# EAGLE design TeensyPrototypeBoard (EAGLE 6.5.0)

## Sheet 1 of 3
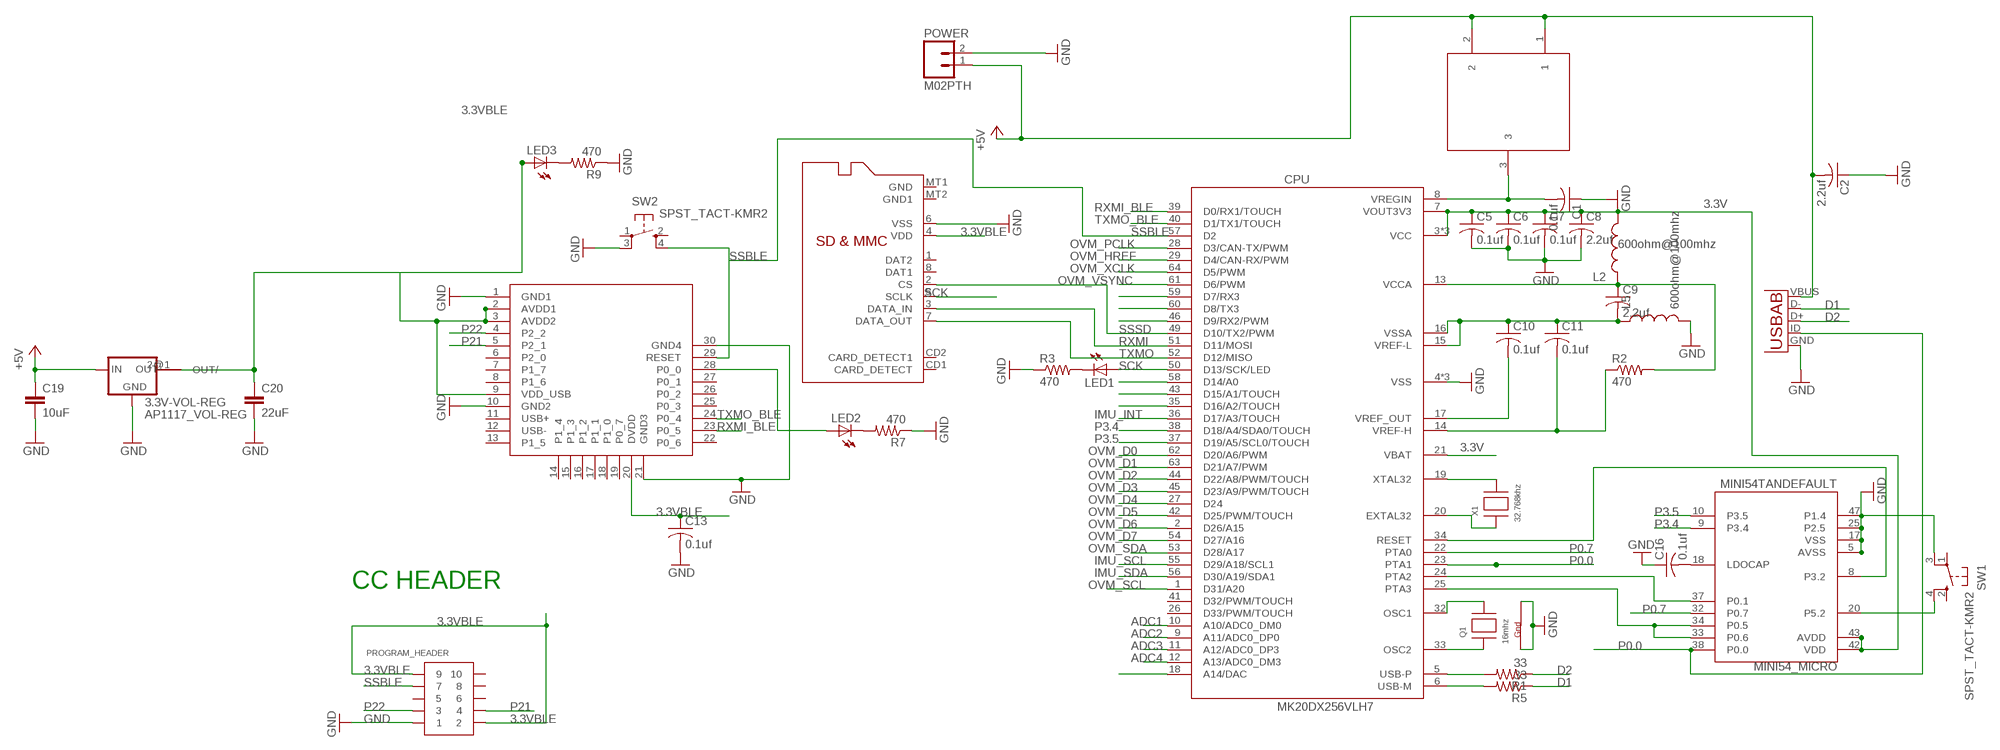
[diagram p0: schematic, sheet 1]

### Parts
3.3V-VOL-REG  AP1117_VOL-REG  [SOT-89]
C1  0.1uf  C-USC0603  [C0603]
C2  2.2uf  C-USC0603  [C0603]
C5  0.1uf  C-USC0603  [C0603]
C6  0.1uf  C-USC0603  [C0603]
C7  0.1uf  C-USC0603  [C0603]
C8  2.2uf  C-USC0603  [C0603]
C9  2.2uf  C-USC0603  [C0603]
C10  0.1uf  C-USC0603  [C0603]
C11  0.1uf  C-USC0603  [C0603]
C13  0.1uf  C-USC0603  [C0603]
C16  0.1uf  C-USC0603  [C0603]
C19  10uF  CAP0603-CAP  [0603-CAP]
C20  22uF  CAP0603-CAP  [0603-CAP]
CPU  MK20DX256VLH7  [QFP50P1200X1200X160-64N]
L2  600ohm@100mhz  INDUCTOR0603  [0603]
L5  600ohm@100mhz  INDUCTOR0603  [0603]
LED1  LEDCHIP-LED0603  [CHIP-LED0603]
LED2  LEDCHIP-LED0603  [CHIP-LED0603]
LED3  LEDCHIP-LED0603  [CHIP-LED0603]
MICRO_SD_CARD_SINK  MICROSD  [MICROSD]
MINI54_MICRO  MINI54TANDEFAULT  [QFP50P900X900X160-48N]
POWER  M02PTH  [1X02]
PROGRAM_HEADER  CONN_5-2-FTSH-V  [FTSH-105-DV]
Q1  16mhz  XTAL-4-3225  [NX3225]
R1  33  R-US_R0603  [R0603]
R2  470  R-US_R0603  [R0603]
R3  470  R-US_R0603  [R0603]
R5  33  R-US_R0603  [R0603]
R7  470  R-US_R0603  [R0603]
R9  470  R-US_R0603  [R0603]
SW1  SPST_TACT-KMR2  [KMR2]
SW2  SPST_TACT-KMR2  [KMR2]
U3  BLE112-A  [BLE112-A]
U$4  PMEG4010CPA  [PMEG4010CPA]
USB  USB-AB  [USB-AB-MICRO-SMD]
X1  32.768khz  XTAL-3.2X1.5  [XTAL3215]

### Nets
3.3V: C5.1 C6.1 C7.1 C8.1 CPU.3(VCC) CPU.7(VOUT3V3) CPU.21(VBAT) CPU.30(VCC) CPU.48(VCC) L2.2 MINI54_MICRO.42(VDD) MINI54_MICRO.43(AVDD)
3.3VBLE: 3.3V-VOL-REG.2(OUT) C13.1 C20.1 LED3.A MICRO_SD_CARD_SINK.4(VDD) PROGRAM_HEADER.2 PROGRAM_HEADER.9 U3.2(AVDD1) U3.3(AVDD2) U3.9(VDD_USB) U3.20(DVDD) ; also sheet 2,3
+5V: 3.3V-VOL-REG.3(IN) C2.2 C19.1 POWER.1 U$4.1 U$4.2 USB.VBUS
ADC1: CPU.10(A10/ADC0_DM0)
ADC2: CPU.9(A11/ADC0_DP0)
ADC3: CPU.11(A12/ADC0_DP3)
ADC4: CPU.12(A13/ADC0_DM3)
D1: R5.1 USB.D-
D2: R1.1 USB.D+
GND: 3.3V-VOL-REG.1(GND) C1.1 C2.1 C5.2 C6.2 C7.2 C8.2 C13.2 C16.1 C19.2 C20.2 CPU.4(VSS) CPU.31(VSS) CPU.47(VSS) L5.2 MICRO_SD_CARD_SINK.6(VSS) MINI54_MICRO.5(AVSS) MINI54_MICRO.17(VSS) MINI54_MICRO.25(P2.5) MINI54_MICRO.47(P1.4) POWER.2 PROGRAM_HEADER.1 Q1.2(G2) Q1.4(G1) R3.1 R7.1 R9.1 SW1.3(P1) SW2.3(P1) U3.1(GND1) U3.10(GND2) U3.21(GND3) U3.30(GND4) USB.GND ; also sheet 2,3
IMU_INT: CPU.36(D17/A3/TOUCH) ; also sheet 2
IMU_SCL: CPU.55(D29/A18/SCL1) ; also sheet 2
IMU_SDA: CPU.56(D30/A19/SDA1) ; also sheet 2
N$1: CPU.19(XTAL32) X1.P$2
N$2: C1.2 CPU.8(VREGIN) U$4.3
N$4: C9.2 C10.1 C11.1 CPU.15(VREF-L) CPU.16(VSSA) L5.1
N$5: C10.2 CPU.17(VREF_OUT)
N$6: C9.1 CPU.13(VCCA) L2.1 R2.2
N$7: C11.2 CPU.14(VREF-H) R2.1
N$8: CPU.20(EXTAL32) X1.P$1
N$9: CPU.32(OSC1) Q1.3(X2)
N$10: CPU.33(OSC2) Q1.1(X1)
N$11: CPU.5(USB-P) R1.2
N$12: CPU.6(USB-M) R5.2
N$13: LED1.C R3.2
N$14: CPU.34(RESET) MINI54_MICRO.8(P3.2)
N$15: CPU.58(D14/A0)
N$16: CPU.43(D15/A1/TOUCH)
N$17: MINI54_MICRO.20(P5.2) SW1.4(S1)
N$18: LED3.C R9.2
N$19: CPU.24(PTA2) MINI54_MICRO.37(P0.1)
N$20: CPU.35(D16/A2/TOUCH)
N$22: CPU.25(PTA3) MINI54_MICRO.33(P0.6) MINI54_MICRO.34(P0.5)
N$26: CPU.18(A14/DAC)
N$28: LED2.C R7.2
N$29: LED2.A U3.28(P0_0)
N$31: CPU.59(D7/RX3)
N$32: CPU.60(D8/TX3)
N$33: CPU.46(D9/RX2/PWM)
N$36: C16.2 MINI54_MICRO.18(LDOCAP)
OVM_D0: CPU.62(D20/A6/PWM) ; also sheet 3
OVM_D1: CPU.63(D21/A7/PWM) ; also sheet 3
OVM_D2: CPU.44(D22/A8/PWM/TOUCH) ; also sheet 3
OVM_D3: CPU.45(D23/A9/PWM/TOUCH) ; also sheet 3
OVM_D4: CPU.27(D24) ; also sheet 3
OVM_D5: CPU.42(D25/PWM/TOUCH) ; also sheet 3
OVM_D6: CPU.2(D26/A15) ; also sheet 3
OVM_D7: CPU.54(D27/A16) ; also sheet 3
OVM_HREF: CPU.29(D4/CAN-RX/PWM) ; also sheet 3
OVM_PCLK: CPU.28(D3/CAN-TX/PWM) ; also sheet 3
OVM_SCL: CPU.1(D31/A20) ; also sheet 3
OVM_SDA: CPU.53(D28/A17) ; also sheet 3
OVM_VSYNC: CPU.61(D6/PWM) ; also sheet 3
OVM_XCLK: CPU.64(D5/PWM) ; also sheet 3
P0.0: CPU.23(PTA1) MINI54_MICRO.38(P0.0) USB.ID(USBID)
P0.7: CPU.22(PTA0) MINI54_MICRO.32(P0.7)
P3.4: CPU.38(D18/A4/SDA0/TOUCH) MINI54_MICRO.9(P3.4)
P3.5: CPU.37(D19/A5/SCL0/TOUCH) MINI54_MICRO.10(P3.5)
P21: PROGRAM_HEADER.4 U3.5(P2_1)
P22: PROGRAM_HEADER.3 U3.4(P2_2)
RXMI: CPU.51(D11/MOSI) MICRO_SD_CARD_SINK.3(DATA_IN)
RXMI_BLE: CPU.39(D0/RX1/TOUCH) U3.23(P0_5)
SCK: CPU.50(D13/SCK/LED) LED1.A MICRO_SD_CARD_SINK.5(SCLK)
SSBLE: CPU.57(D2) PROGRAM_HEADER.7 SW2.4(S1) U3.29(RESET)
SSSD: CPU.49(D10/TX2/PWM) MICRO_SD_CARD_SINK.2(CS)
TXMO: CPU.52(D12/MISO) MICRO_SD_CARD_SINK.7(DATA_OUT)
TXMO_BLE: CPU.40(D1/TX1/TOUCH) U3.24(P0_4)
Unconnected: 3.3V-VOL-REG.2@1(OUT/) CPU.26(D33/PWM/TOUCH) CPU.41(D32/PWM/TOUCH) MICRO_SD_CARD_SINK.1(DAT2) MICRO_SD_CARD_SINK.8(DAT1) MICRO_SD_CARD_SINK.CD1(CARD_DETECT) MICRO_SD_CARD_SINK.CD2(CARD_DETECT1) MICRO_SD_CARD_SINK.MT1(GND) MICRO_SD_CARD_SINK.MT2(GND1) PROGRAM_HEADER.5 PROGRAM_HEADER.6 PROGRAM_HEADER.8 PROGRAM_HEADER.10 SW1.1(P) SW1.2(S) SW2.1(P) SW2.2(S) U3.6(P2_0) U3.7(P1_7) U3.8(P1_6) U3.11(USB+) U3.12(USB-) U3.13(P1_5) U3.14(P1_4) U3.15(P1_3) U3.16(P1_2) U3.17(P1_1) U3.18(P1_0) U3.19(P0_7) U3.22(P0_6) U3.25(P0_3) U3.26(P0_2) U3.27(P0_1)

### Notes on the sheet
- CC HEADER

## Sheet 2 of 3: IMU
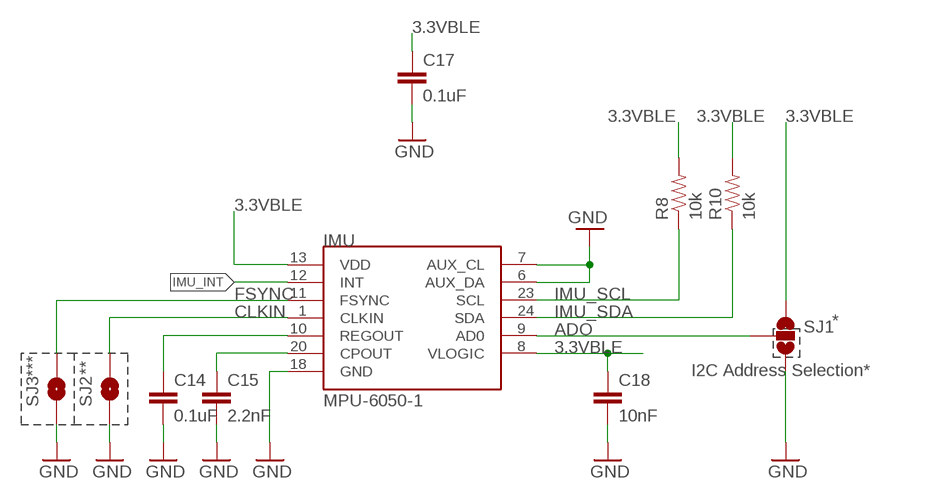
[diagram p1: schematic, sheet 2]

### Parts
C14  0.1uF  CAP0603-CAP  [0603-CAP]
C15  2.2nF  CAP0603-CAP  [0603-CAP]
C17  0.1uF  CAP0603-CAP  [0603-CAP]
C18  10nF  CAP0603-CAP  [0603-CAP]
IMU  MPU-6050-1  [QFN-24-4MM2]
R8  10k  RESISTOR0603-RES  [0603-RES]
R10  10k  RESISTOR0603-RES  [0603-RES]
SJ1  SOLDERJUMPER_2WAYPASTE2&3  [SJ_3_PASTE2&3]
SJ2  SOLDERJUMPERTRACE  [SJ_2S-TRACE]
SJ3  SOLDERJUMPERTRACE  [SJ_2S-TRACE]

### Nets
3.3VBLE: C17.1 C18.1 IMU.8(VLOGIC) IMU.13(VDD) R8.2 R10.2 SJ1.1 ; also sheet 1,3
ADO: IMU.9(AD0) SJ1.2
CLKIN: IMU.1(CLKIN) SJ2.2
FSYNC: IMU.11(FSYNC) SJ3.2
GND: C14.2 C15.2 C17.2 C18.2 IMU.6(AUX_DA) IMU.7(AUX_CL) IMU.18(GND) SJ1.3 SJ2.1 SJ3.1 ; also sheet 1,3
IMU_INT: IMU.12(INT) ; also sheet 1
IMU_SCL: IMU.23(SCL) R8.1 ; also sheet 1
IMU_SDA: IMU.24(SDA) R10.1 ; also sheet 1
N$3: C15.1 IMU.20(CPOUT)
N$23: C14.1 IMU.10(REGOUT)

### Notes on the sheet
- *
- *** | ** | I2C Address Selection*

## Sheet 3 of 3: CAMERA MODULE
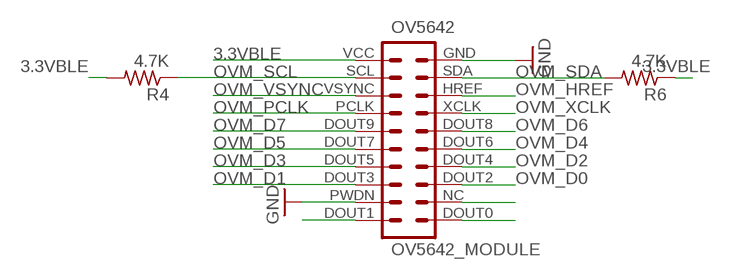
[diagram p2: schematic, sheet 3]

### Parts
OV5642  OV5642_MODULE  [OV5642_MODULE]
R4  4.7K  R-US_R0603  [R0603]
R6  4.7K  R-US_R0603  [R0603]

### Nets
3.3VBLE: OV5642.VCC R4.2 R6.1 ; also sheet 1,2
GND: OV5642.GND OV5642.PWDN ; also sheet 1,2
N$41: OV5642.DOUT1
N$48: OV5642.NC
N$49: OV5642.DOUT0
OVM_D0: OV5642.DOUT2 ; also sheet 1
OVM_D1: OV5642.DOUT3 ; also sheet 1
OVM_D2: OV5642.DOUT4 ; also sheet 1
OVM_D3: OV5642.DOUT5 ; also sheet 1
OVM_D4: OV5642.DOUT6 ; also sheet 1
OVM_D5: OV5642.DOUT7 ; also sheet 1
OVM_D6: OV5642.DOUT8 ; also sheet 1
OVM_D7: OV5642.DOUT9 ; also sheet 1
OVM_HREF: OV5642.HREF ; also sheet 1
OVM_PCLK: OV5642.PCLK ; also sheet 1
OVM_SCL: OV5642.SCL R4.1 ; also sheet 1
OVM_SDA: OV5642.SDA R6.2 ; also sheet 1
OVM_VSYNC: OV5642.VSYNC ; also sheet 1
OVM_XCLK: OV5642.XCLK ; also sheet 1

## Library data of the parts
3.3V-VOL-REG = Chao:AP1117_VOL-REG
C1 C2 C5-C11 C13 C16 = resistor:C-US: CAPACITOR, American symbol
C14 C15 C17-C20 = SparkFun:CAP: Capacitor Standard 0603 ceramic capacitor, and 0.1" leaded capacitor.
CPU = Teensy_3_Series_Chip_v1.0:MK20DX256VLH7: This is a footprint for the MK20dx256VHL7, the chip at the heart of the Teensy 3.1. Notable upgrades over the Teensy 3.0 include more Flash Memory, RAM, a DAC output, additional ADC pins, etc. Remember, if you want to use USB, VOut3v3 has to be attached to the 3.3V bus.
IMU = Testing:MPU-6050
L2 L5 = SparkFun-Passives:INDUCTOR: Inductors Basic Inductor/Choke - 0603 and 1206. Footprints are not proven and vary greatly between part numbers. SRN6045- 33uH, 20% 1.4A
LED1-LED3 = adafruit:LED: LED OSRAM: - CHIPLED LG R971, LG N971, LY N971, LG Q971, LY Q971, LO R971, LY R971 LH N974, LH R974 LS Q976, LO Q976, LY Q976 LO Q996 - Hyper CHIPLED LW Q18S LB Q993, LB Q99A, LB R99A - SideLED LS A670, LO A670, LY A670, LG A670, LP A670 LB A673, LV A673, LT A673, LW A673 LH A674 LY A675 LS A676, LA A676, LO A676, LY A676, LW A676 LS A679, LY A679, LG A679 - Hyper Micro SIDELED® LS Y876, LA Y876, LO Y876, LY Y876 LT Y87S - SmartLED LW L88C, LW L88S LB L89C, LB L89S, LG L890 LS L89K, LO L89K, LY L89K LS L896, LA L896, LO L896, LY L896 - TOPLED LS T670, LO T670, LY T670, LG T670, LP T670 LSG T670, LSP T670, LSY T670, LOP T670, LYG T670 LG T671, LOG T671, LSG T671 LB T673, LV T673, LT T673, LW T673 LH T674 LS T676, LA T676, LO T676, LY T676, LB T676, LH T676, LSB T676, LW T676 LB T67C, LV T67C, LT T67C, LS T67K, LO T67K, LY T67K, LW E67C LS E67B, LA E67B, LO E67B, LY E67B, LB E67C, LV E67C, LT E67C LW T67C LS T679, LY T679, LG T679 LS T770, LO T770, LY T770, LG T770, LP T770 LB T773, LV T773, LT T773, LW T773 LH T774 LS E675, LA E675, LY E675, LS T675 LS T776, LA T776, LO T776, LY T776, LB T776 LHGB T686 LT T68C, LB T68C - Hyper Mini TOPLED® LB M676 - Mini TOPLED Santana® LG M470 LS M47K, LO M47K, LY M47K Source: http://www.osram.convergy.de/
MICRO_SD_CARD_SINK = adafruit:MICROSD: Micro-SD / Transflash card holder with SPI pinout For the 3M # 2908-05WB-MG and/or 4UCON #19656 push-push type
MINI54_MICRO = Teensy_3_Series_Chip_v1.0:MINI54TAN: MINI54TAN Bootloader from PJRC.com, preprogrammed with Teensy 3.0 bootloader. https://www.pjrc.com/store/ic_mini54_tqfp.html
OV5642 = Chao:OV5642_MODULE
POWER = SparkFun-Connectors:M02: Standard 2-pin 0.1" header. Use with - straight break away headers ( PRT-00116) - right angle break away headers (PRT-00553) - swiss pins (PRT-00743) - machine pins (PRT-00117) - female headers (PRT-00115) Molex polarized connector foot print use with: PRT-08233 with associated crimp pins and housings. 2.54_SCREWTERM for use with PRT-10571. 3.5mm Screw Terminal footprints for PRT-08084 5mm Screw Terminal footprints for use with PRT-08433
PROGRAM_HEADER = pel_misc:CONN_5-2
Q1 = adafruit:XTAL-4: Classic 4-pin 3.2 x 2.5mm crystal
R1-R7 R9 = resistor:R-US_: RESISTOR, American symbol
R8 R10 = SparkFun:RESISTOR: Resistor Basic schematic elements and footprints for 0603, 1206, and PTH resistors.
SJ1 = SparkFun:SOLDERJUMPER_2WAY: Solder Jumper 2 way solder jumper
SJ2 SJ3 = SparkFun:SOLDERJUMPER: Solder Jumper Standard SMD solder jumper. Used to automate production. Two varients : Normally Open and Normally Closed are the same, but have different paste layers. NC will have a large amount of paste and should jumper during reflow.
SW1 SW2 = adafruit:SPST_TACT: SMT 6mm switch, EVQQ2 series http://www.ladyada.net/library/eagle
U3 = SparkFun-RF:BLE112-A: BlueGiga Bluetooth 4.0 module with integrated chip antenna and onboard 8051 processor and peripherals
U$4 = zz_cbhar:PMEG4010CPA
USB = SparkFun-Connectors:USB-AB: This is a USB AB connector that is compatible with USB OTG. i.e. this connector can serve as a host or device
X1 = adafruit:XTAL: Low cost SMT crystals, no capacitors included http://www.ladyada.net/library/eagle

## Board
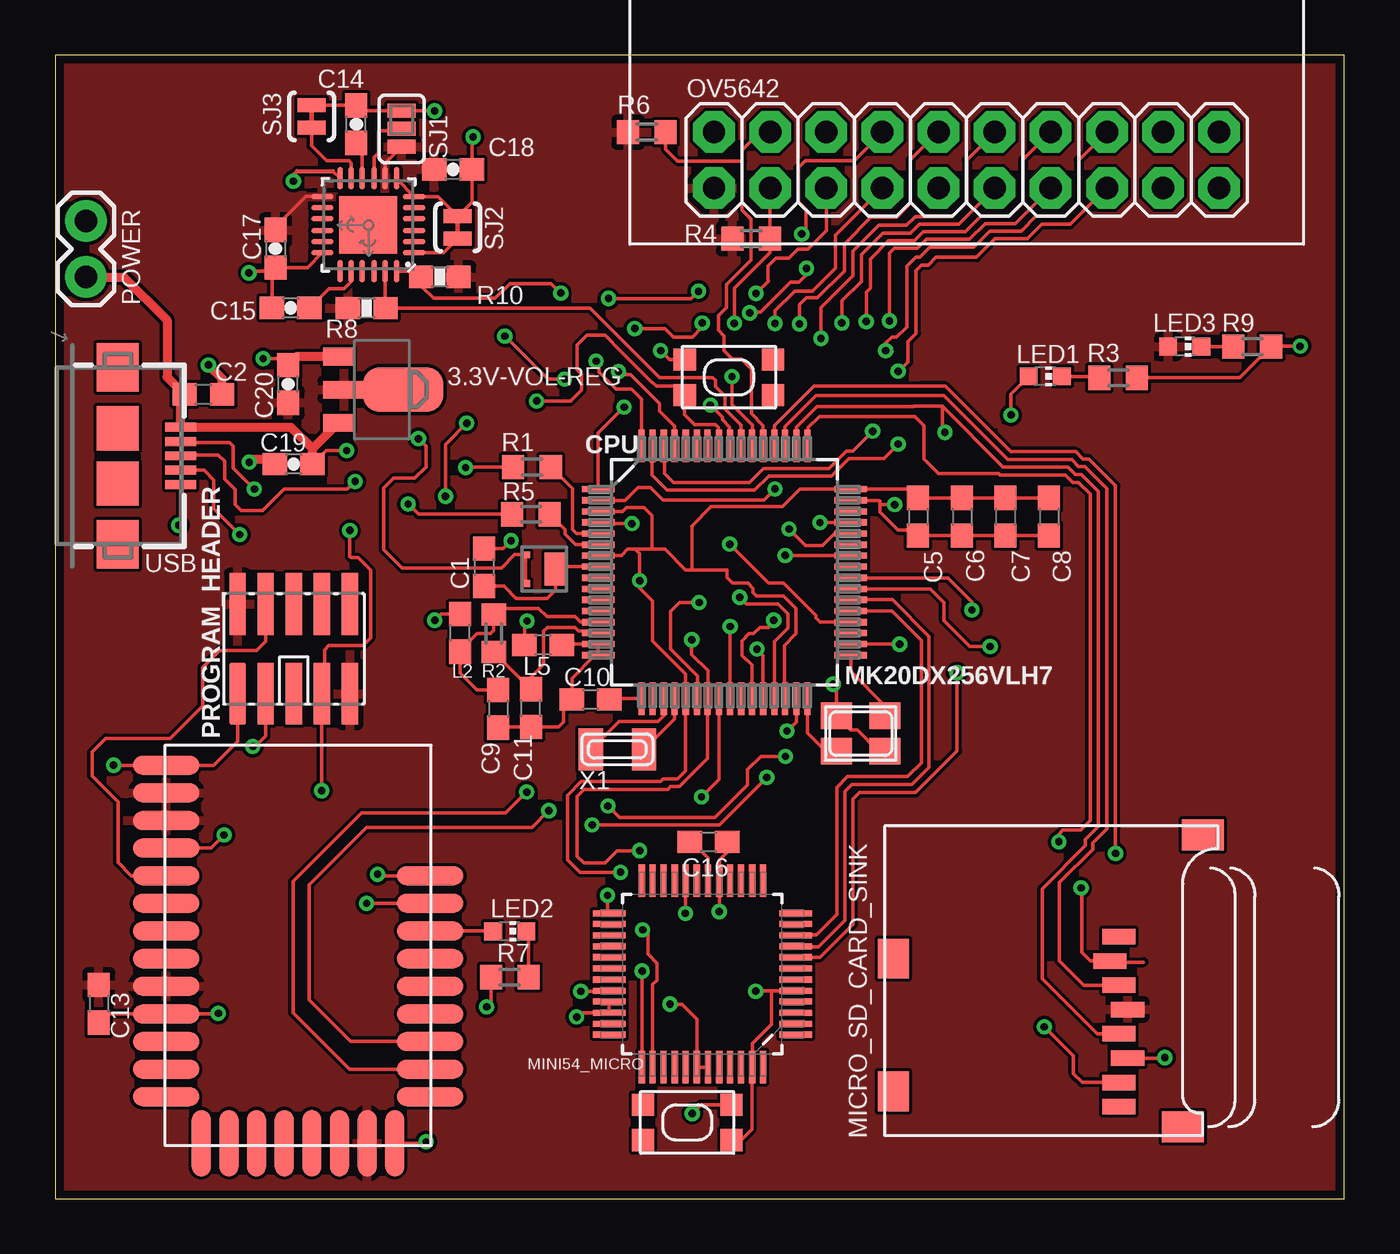
[diagram p3: board, top side]
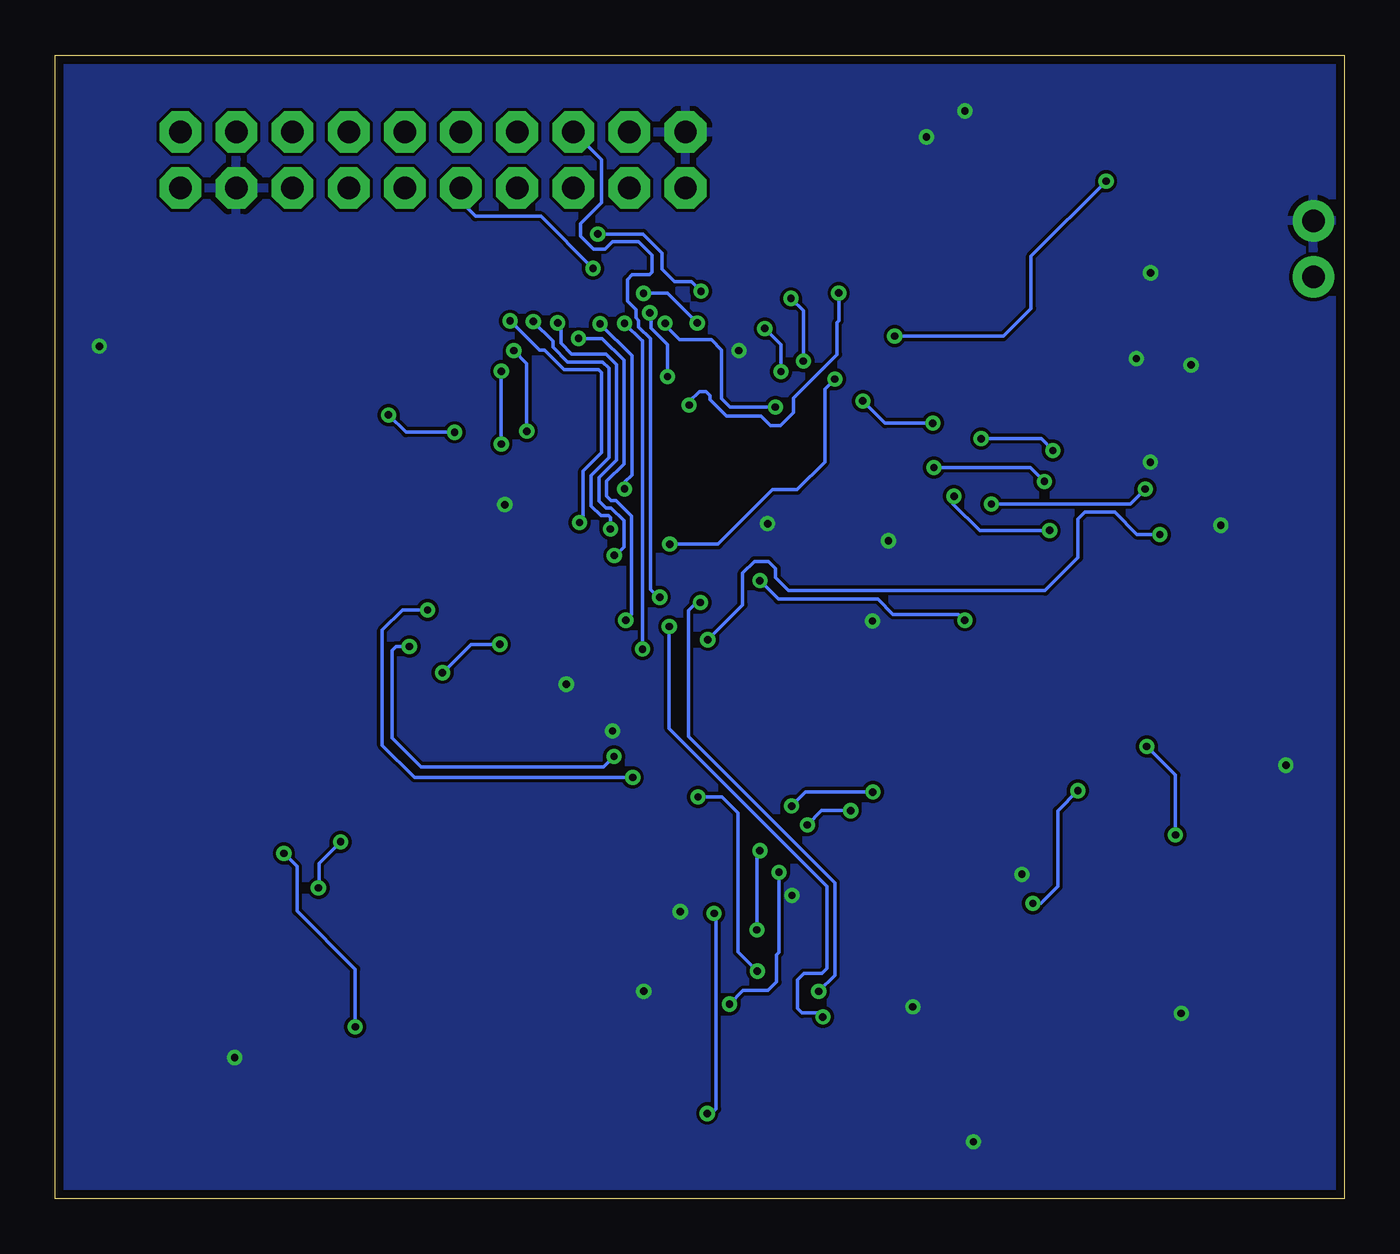
[diagram p4: board, bottom side, seen from below]

Size 58.32 x 51.74 mm. Coordinates in mm from the lower left corner, seen from the top.
Outline: 0,0 58.32,0 58.32,51.74 0,51.74 0,0
Copper layers (1*16): Top 0.0356mm / dielectric 1.5011mm / Bottom 0.0356mm
Design rules "LaenPCBOrder": minimum track width 6mil, minimum drill 13mil, track to track 6mil, track to pad 6mil, pad to pad 6mil, via to via 6mil, smd to smd 6mil, copper to edge 15mil, drill to drill 6mil, minimum pad ring 7mil, minimum via ring 7mil, stop-mask expansion 3mil, vias tented up to drill 0mil, thermal gap 10mil

### Footprints (pad centres in the part's own frame; a part is rotated, then mirrored left to right if it is on the bottom)
SOT-89 = smd 0.8 x 1.4: 1 -1.499,-1.981; 3 1.499,-1.981 | smd 0.8 x 1.9: 2 0,-1.727 | smd 2.032 x 3.65: 2@1 0,0.94
C0603 = smd 1.1 x 1: 1 -0.85,0; 2 0.85,0
0603-CAP = smd 1.1 x 1: 1 -0.85,0; 2 0.85,0
QFP50P1200X1200X160-64N = smd 1.473 x 0.279: 1 -5.715,3.759; 2 -5.715,3.251; 3 -5.715,2.743; 4 -5.715,2.261; 5 -5.715,1.753; 6 -5.715,1.245; 7 -5.715,0.762; 8 -5.715,0.254; 9 -5.715,-0.254; 10 -5.715,-0.762; 11 -5.715,-1.245; 12 -5.715,-1.753; 13 -5.715,-2.261; 14 -5.715,-2.743; 15 -5.715,-3.251; 16 -5.715,-3.759; 33 5.715,-3.759; 34 5.715,-3.251; 35 5.715,-2.743; 36 5.715,-2.261; 37 5.715,-1.753; 38 5.715,-1.245; 39 5.715,-0.762; 40 5.715,-0.254; 41 5.715,0.254; 42 5.715,0.762; 43 5.715,1.245; 44 5.715,1.753; 45 5.715,2.261; 46 5.715,2.743; 47 5.715,3.251; 48 5.715,3.759 | smd 0.279 x 1.473: 17 -3.759,-5.715; 18 -3.251,-5.715; 19 -2.743,-5.715; 20 -2.261,-5.715; 21 -1.753,-5.715; 22 -1.245,-5.715; 23 -0.762,-5.715; 24 -0.254,-5.715; 25 0.254,-5.715; 26 0.762,-5.715; 27 1.245,-5.715; 28 1.753,-5.715; 29 2.261,-5.715; 30 2.743,-5.715; 31 3.251,-5.715; 32 3.759,-5.715; 49 3.759,5.715; 50 3.251,5.715; 51 2.743,5.715; 52 2.261,5.715; 53 1.753,5.715; 54 1.245,5.715; 55 0.762,5.715; 56 0.254,5.715; 57 -0.254,5.715; 58 -0.762,5.715; 59 -1.245,5.715; 60 -1.753,5.715; 61 -2.261,5.715; 62 -2.743,5.715; 63 -3.251,5.715; 64 -3.759,5.715
QFN-24-4MM2 = smd 1.016 x 0.254: 1 -2.066,1.257; 2 -2.066,0.75; 3 -2.066,0.247; 4 -2.066,-0.287; 5 -2.066,-0.792; 6 -2.066,-1.297; 13 2.086,-1.297; 14 2.086,-0.792; 15 2.086,-0.287; 16 2.086,0.247; 17 2.086,0.75; 18 2.086,1.257 | smd 0.254 x 1.016: 7 -1.267,-2.122; 8 -0.762,-2.122; 9 -0.258,-2.122; 10 0.278,-2.122; 11 0.78,-2.122; 12 1.287,-2.122; 19 1.287,2.082; 20 0.78,2.082; 21 0.278,2.082; 22 -0.258,2.082; 23 -0.762,2.082; 24 -1.267,2.082 | smd 2.616 x 2.616: P$1 0.02,-0.01
0603 = smd 1.1 x 1: 1 -0.85,0; 2 0.85,0
CHIP-LED0603 = smd 0.8 x 0.8: A 0,-0.75; C 0,0.75
MICROSD = smd 0.7 x 1.5: 1 9,-10.64; 2 7.9,-10.24; 3 6.8,-10.64; 4 5.7,-11.04; 5 4.6,-10.64; 6 3.5,-11.04; 7 2.4,-10.64; 8 1.3,-10.64 | smd 1.8 x 1.4: CD1 2,-0.44; CD2 8,-0.44 | smd 1.4 x 1.9: MT1 0.4,-13.54; MT2 13.6,-14.44
QFP50P900X900X160-48N = smd 1.473 x 0.279: 1 -4.216,2.743; 2 -4.216,2.261; 3 -4.216,1.753; 4 -4.216,1.245; 5 -4.216,0.762; 6 -4.216,0.254; 7 -4.216,-0.254; 8 -4.216,-0.762; 9 -4.216,-1.245; 10 -4.216,-1.753; 11 -4.216,-2.261; 12 -4.216,-2.743; 25 4.216,-2.743; 26 4.216,-2.261; 27 4.216,-1.753; 28 4.216,-1.245; 29 4.216,-0.762; 30 4.216,-0.254; 31 4.216,0.254; 32 4.216,0.762; 33 4.216,1.245; 34 4.216,1.753; 35 4.216,2.261; 36 4.216,2.743 | smd 0.279 x 1.473: 13 -2.743,-4.216; 14 -2.261,-4.216; 15 -1.753,-4.216; 16 -1.245,-4.216; 17 -0.762,-4.216; 18 -0.254,-4.216; 19 0.254,-4.216; 20 0.762,-4.216; 21 1.245,-4.216; 22 1.753,-4.216; 23 2.261,-4.216; 24 2.743,-4.216; 37 2.743,4.216; 38 2.261,4.216; 39 1.753,4.216; 40 1.245,4.216; 41 0.762,4.216; 42 0.254,4.216; 43 -0.254,4.216; 44 -0.762,4.216; 45 -1.245,4.216; 46 -1.753,4.216; 47 -2.261,4.216; 48 -2.743,4.216
OV5642_MODULE = drill 1.016 pad 1.88 octagon: DOUT0 11.43,1.27; DOUT1 11.43,-1.27; DOUT2 6.35,1.27; DOUT3 6.35,-1.27; DOUT4 3.81,1.27; DOUT5 3.81,-1.27; DOUT6 1.27,1.27; DOUT7 1.27,-1.27; DOUT8 -1.27,1.27; DOUT9 -1.27,-1.27; GND -11.43,1.27; HREF -6.35,1.27; NC 8.89,1.27; PCLK -3.81,-1.27; PWDN 8.89,-1.27; SCL -8.89,-1.27; SDA -8.89,1.27; VCC -11.43,-1.27; VSYNC -6.35,-1.27; XCLK -3.81,1.27
1X02 = drill 1.016 pad 1.88: 1 0,0; 2 2.54,0
FTSH-105-DV = smd 0.74 x 2.8: 1 -2.54,-2.03; 2 -2.54,2.03; 3 -1.27,-2.03; 4 -1.27,2.03; 5 0,-2.03; 6 0,2.03; 7 1.27,-2.03; 8 1.27,2.03; 9 2.54,-2.03; 10 2.54,2.03
NX3225 = smd 1.4 x 1.2: 1 -1.1,-0.8; 2 1.1,-0.8; 3 1.1,0.8; 4 -1.1,0.8
R0603 = smd 1 x 1.1: 1 -0.85,0; 2 0.85,0
0603-RES = smd 1.1 x 1: 1 -0.85,0; 2 0.85,0
SJ_3_PASTE2&3 = smd 0.635 x 1.27: 1 -0.813,0; 2 0,0; 3 0.813,0
SJ_2S-TRACE = smd 0.635 x 1.27: 1 -0.508,0; 2 0.508,0
KMR2 = smd 1 x 1: 1 2,0.8; 2 2,-0.8; 3 -2,0.8; 4 -2,-0.8
BLE112-A = smd 3 x 0.85: 1 0.05,17.2; 2 0.05,15.95; 3 0.05,14.7; 4 0.05,13.45; 5 0.05,12.2; 6 0.05,10.95; 7 0.05,9.7; 8 0.05,8.45; 9 0.05,7.2; 10 0.05,5.95; 11 0.05,4.7; 12 0.05,3.45; 13 0.05,2.2; 22 12,2.2; 23 12,3.45; 24 12,4.7; 25 12,5.95; 26 12,7.2; 27 12,8.45; 28 12,9.7; 29 12,10.95; 30 12,12.2 | smd 0.85 x 3: 14 1.65,0.1; 15 2.9,0.1; 16 4.15,0.1; 17 5.4,0.1; 18 6.65,0.1; 19 7.9,0.1; 20 9.15,0.1; 21 10.4,0.1
PMEG4010CPA = smd 0.3 x 0.4: 1 -0.65,-0.85; 2 0.65,-0.85 | smd 1.5 x 1: 3 0,0.5
USB-AB-MICRO-SMD = smd 1.4 x 0.4: D+ 2.85,0; D- 2.85,0.65; GND 2.85,-1.3; ID 2.85,-0.65; VBUS 2.85,1.3 | smd 1.9 x 2: P$6 0,1.25; P$7 0,-1.25 | smd 1.9 x 2.2: P$8 0,4; P$9 0,-4
XTAL3215 = smd 1.1 x 1.9: P$1 1.2,0; P$2 -1.2,0

### Placement (x,y rotation side)
3.3V-VOL-REG  14.79,36.61 270 top
C1  19.4,28.57 270 top
C2  6.7,36.39 180 top
C5  39.04,30.86 270 top
C6  41.02,30.86 270 top
C7  42.99,30.86 270 top
C8  44.96,30.86 270 top
C9  20.04,22.17 270 top
C10  24.22,22.6 0 top
C11  21.52,22.2 90 top
C13  1.97,8.82 270 top
C14  13.62,48.62 90 top
C15  10.65,40.31 180 top
C16  29.56,16.14 180 top
C17  9.96,42.98 270 top
C18  18,46.57 0 top
C19  10.78,33.24 180 top
C20  10.54,36.87 90 top
CPU  30.28,28.35 0 top
IMU  14.17,44.06 180 top
L2  18.32,25.61 90 top
L5  22.08,25.06 180 top
LED1  44.79,37.21 270 top
LED2  20.56,12.1 270 top
LED3  51.11,38.56 270 top
MICRO_SD_CARD_SINK  37.48,2.86 90 top
MINI54_MICRO  29.28,10.17 180 top
OV5642  41.24,47 0 top
POWER  1.39,41.71 90 top
PROGRAM_HEADER  10.79,24.88 0 top
Q1  36.45,21.05 180 top
R1  21.57,33.11 0 top
R2  19.84,25.58 90 top
R3  48.09,37.15 180 top
R4  31.49,43.44 180 top
R5  21.52,30.97 0 top
R6  26.76,48.26 0 top
R7  20.56,10.03 0 top
R8  14.1,40.3 180 top
R9  54.16,38.56 180 top
R10  17.4,41.71 0 top
SJ1  15.68,48.41 90 top
SJ2  18.21,43.95 270 top
SJ3  11.6,48.98 270 top
SW1  28.59,3.45 180 top
SW2  30.48,37.17 0 top
U3  4.96,2.42 0 top
U$4  22.13,28.49 270 top
USB  2.83,33.61 0 top
X1  25.44,20.34 0 top

### Tracks (layer width: path | path; a pad name or v marks a point on that pad's centre or on a via)
3.3V  (via drill 0.33)
  Top 0.152: CPU.3 25.67,31.09 25.85,31.27 26.64,31.27 26.99,30.91 26.99,29.39 | CPU.7 25.61,29.11 25.89,29.39 26.24,29.39 | CPU.30 32.99,22.67 32.99,25.04 33.52,25.57 33.52,26.71 32.95,27.28 31.73,27.28 31.58,27.43 31.58,27.62 31.35,27.85 30.64,27.85 30.39,28.11 30.39,28.44 28.82,28.44 | 26.99,29.39 27.58,29.39 28.53,28.44 28.82,28.44 | 26.99,29.39 26.24,29.39 | C8.1 C7.1 C6.1 C5.1 38.64,32.11 CPU.48 33.7,32.11 32.9,31.32 29.67,31.32 28.8,30.45 28.8,28.47 28.82,28.44 | L2.2 17.45,26.46 v17.17,26.18 | 26.24,29.39 26.44,29.19 v26.44,27.97 26.44,27.63 27.03,27.04 27.03,25.25 28.52,23.75 CPU.21 28.53,19.37 28.16,19 27.5,19 27.38,18.87 23.79,18.87 23.18,18.26 23.18,15.34 23.75,14.77 v25.58,14.77 | MINI54_MICRO.43 MINI54_MICRO.42 29.04,5.97 29.04,8.12 28.35,8.8 v27.81,8.8
  Bottom 0.152: v17.17,26.18 17.19,26.18 17.45,26.44 20.42,26.44 21.1,27.13 25.61,27.13 v26.44,27.97 | v27.81,8.8 27.2,9.42 26.07,9.42 25.69,9.81 25.69,11.03 25.58,11.14 v25.58,14.77
3.3VBLE
  Top 0.152: C17.1 9.97,43.99 11.34,45.37 12.07,45.37 IMU.13 | IMU.8 14.94,46.86 SJ1.1
  pour Top: -3.81,55.88 62.23,55.88 62.23,-1.27 -3.81,-1.27
+5V  (via drill 0.33)
  Top 0.152: U$4.2 U$4.1 20.79,29.14 20.19,28.54 15.7,28.54 14.87,29.37 14.87,32.16 15.3,32.6 16.27,32.6 16.77,33.1 16.77,34.05 v16.43,34.39 | C19.1 12.25,33.85 v13.18,33.85
  Top 0.406: C19.1 11.63,33.93 | 11.63,33.93 3.3V-VOL-REG.3 | POWER.1 3.11,41.7 5.06,39.75 5.06,37.19 C2.2 5.68,36.22 USB.VBUS 10.65,34.91 11.63,33.93
  Bottom 0.152: v13.18,33.85 13.71,34.39 v16.43,34.39
ADO
  Top 0.152: IMU.9 14.44,47.13 14.63,47.32 14.63,48.28 14.67,48.32 15.59,48.32 SJ1.2
CLKIN
  Top 0.152: IMU.1 17.57,42.8 SJ2.2
D1  (via drill 0.33)
  Top 0.152: USB.D- 5.73,34.22 7.89,34.22 8.05,34.05 8.05,33.06 v9.01,32.11 v9.01,32.1 | v15.97,31.44 16.43,30.97 R5.1
  Bottom 0.152: v9.01,32.11 9.68,31.44 v15.97,31.44
D2  (via drill 0.33)
  Top 0.152: USB.D+ 5.7,33.59 5.77,33.66 7.38,33.66 7.67,33.37 7.67,32.55 8.13,32.08 8.13,31.42 8.41,31.15 9.37,31.15 10.35,32.12 13.21,32.12 13.54,32.46 v13.57,32.46 | v18.56,33.08 18.59,33.11 R1.1
  Bottom 0.152: v13.57,32.46 14.2,33.08 v18.56,33.08
FSYNC
  Top 0.152: 11.6,48.21 SJ3.2 11.6,47.64 12.28,46.96 13.29,46.96 13.39,46.85 IMU.11
GND  (via drill 0.33)
  Top 0.152: IMU.7 15.44,46.15 IMU.6 17.32,45.35 SJ2.1 18.85,45.1 C18.2 18.85,47.99 v18.9,48.05 | C15.2 9.8,41.97 | 9.8,41.97 C17.2 11.42,42.13 IMU.18 | 9.8,41.97 8.84,41.97 v8.76,41.89 | C13.2 2.36,8.37 U3.10 7.35,8.37 v7.38,8.39 | U3.21 16.72,2.52 v16.78,2.58 | R7.1 19.71,8.87 v19.52,8.68 | U3.30 14.65,14.62 v14.58,14.68 | v2.64,19.62 v2.64,19.61 U3.1 7.17,19.61 8.24,20.68 PROGRAM_HEADER.1 | MICRO_SD_CARD_SINK.6 50.18,6.36 v50.2,6.39 | USB.GND 5.68,30.57 v5.58,30.47 | C8.2 C7.2 | C7.2 | C7.2 C6.2 C5.2 | C5.2 | CPU.47 37.27,31.6 37.3,31.57 37.3,31.41 | 37.3,31.41 37.3,31.08 38.12,30.26 38.78,30.26 C5.2 | v37.98,31.4 37.32,31.4 37.3,31.41 | v26.09,30.55 24.63,30.55 CPU.4 | L5.2 21.23,26.01 v21.35,26.14 | C1.1 20.27,29.42 v20.62,29.77 | Q1.4 37.26,20.25 36.29,21.21 35.98,21.21 Q1.2 35.35,23.13 v35.2,23.28 | CPU.31 33.53,21.58 v33.11,21.16 | v56.33,38.57 55.02,38.57 R9.1 53.6,37.15 R3.1 | SW1.3 31.03,2.65 31.52,3.15 31.52,5.94 MINI54_MICRO.47 31.54,7.03 32.41,7.9 32.41,9.41 | C16.1 30.41,15.7 30.05,15.34 MINI54_MICRO.17 | MINI54_MICRO.17 | MINI54_MICRO.17 v30.05,12.99 v30.04,12.99 | MINI54_MICRO.5 32.41,9.41 | 32.41,9.41 31.71,9.41 v31.69,9.39 | MINI54_MICRO.25 24.99,12.99 v24.99,13.72 | C20.2 10.25,38.01 v9.4,38.01 | SJ3.1 13.54,49.48 C14.2 13.8,49.22 SJ1.3 v17.16,49.22 | SW2.3 27.8,37.97 v27.39,38.38
  Top 0.406: 5,19.63 U3.1 | C19.2 9.72,33.46 8.9,33.46 v8.77,33.33 | C2.1 7.55,37.1 v6.93,37.73 | 3.3V-VOL-REG.1 10.93,38.1 C20.2
  pour Bottom: -3.81,55.88 62.23,55.88 62.23,-1.27 -3.81,-1.27
IMU_INT  (via drill 0.33)
  Top 0.152: CPU.36 34.61,26.09 34.42,26.28 34.42,26.4 32.95,27.87 32.26,27.87 v30.51,29.62 | v23.05,37.08 22.29,37.08 v20.34,39.03 | v10.77,46.05 10.77,46.33 10.94,46.5 | 12.56,46.5 IMU.12
  Top 0.178: 10.94,46.5 12.56,46.5
  Bottom 0.152: v30.51,29.62 28.33,29.62 25.86,32.09 24.75,32.09 23.5,33.34 23.5,36.63 v23.05,37.08 | v20.34,39.03 15.43,39.03 14.17,40.28 14.17,42.65 v10.77,46.05
IMU_SCL
  Top 0.152: IMU.23 14.94,40.32 R8.1 24.19,40.3 27.34,37.16 29.75,37.16 29.87,37.03 29.87,36.75 30.3,36.33 30.3,35.73 31.03,35 31.03,34.08 CPU.55
IMU_SDA  (via drill 0.33)
  Top 0.152: IMU.24 16.29,41.97 R10.1 16.55,41.3 17.11,40.74 19.91,40.74 20.58,41.42 22.44,41.42 v22.87,40.98 | CPU.56 30.51,34.08 30.51,34.92 30.18,35.26 30.18,35.37 v29.64,35.91
  Bottom 0.152: v22.87,40.98 22.87,39.73 22.95,39.65 22.95,38.2 24.93,36.23 24.93,35.58 25.51,34.99 25.96,34.99 26.39,35.42 27.96,35.42 28.7,36.17 28.7,36.34 28.89,36.52 29.18,36.52 29.64,36.06 v29.64,35.91
N$1
  Top 0.152: X1.P$2 25.5,21.6 27.27,21.6 27.54,21.86 CPU.19
N$2
  Top 0.152: CPU.8 22.75,28.6 U$4.3 22.63,27.54 22.26,27.17 20.85,27.17 20.3,27.72 C1.2
N$3
  Top 0.152: IMU.20 13.39,41.5 13.08,41.19 12.38,41.19 C15.1
N$4
  Top 0.152: C9.2 20.07,21.35 C11.1 22.77,21.35 23,21.58 23,22.22 C10.1 23.37,23.55 24.41,24.59 CPU.16 CPU.15 22.96,25.1 L5.1
N$5
  Top 0.152: CPU.17 25.11,22.63 C10.2
N$6
  Top 0.152: C9.1 19.09,23.02 18.33,23.78 L2.1 | L2.1 | L2.1 18.33,24.81 19.09,25.58 19.71,25.58 19.84,25.7 R2.2 20.12,26.71 21.87,26.71 22.25,26.33 23.52,26.33 23.76,26.09 CPU.13
N$7
  Top 0.152: R2.1 C11.2 21.52,23.61 22.1,24.18 22.1,25.68 22.27,25.86 23.52,25.86 23.68,25.7 24.47,25.7 CPU.14
N$8
  Top 0.152: X1.P$1 28.02,21.72 CPU.20
N$9
  Top 0.152: Q1.3 34.86,20.25 34.04,21.07 CPU.32
N$10
  Top 0.152: Q1.1 37.55,22.3 35.99,23.86 CPU.33
N$11
  Top 0.152: CPU.5 23.58,30.1 23.39,30.29 23.39,32.14 R1.2
N$12
  Top 0.152: CPU.6 23.55,29.59 23.07,30.07 23.07,30.28 R5.2
N$13
  Top 0.152: LED1.C 47.18,37.21 R3.2
N$14  (via drill 0.33)
  Top 0.152: MINI54_MICRO.8 34.6,10.93 36.1,12.42 36.1,18.09 36.38,18.38 38.93,18.38 40.8,20.25 v40.8,23.8 | v38.21,25.09 v38.2,25.1 CPU.34
  Bottom 0.152: v40.8,23.8 39.51,25.09 v38.21,25.09
N$17  (via drill 0.33)
  Top 0.152: SW1.4 29.22,4.25 v28.82,3.86 | v28.51,12.91 MINI54_MICRO.20
  Bottom 0.152: v28.82,3.86 28.63,3.86 28.42,4.07 28.42,12.82 v28.51,12.91
N$18
  Top 0.152: R9.2 LED3.C
N$19  (via drill 0.33)
  Top 0.152: MINI54_MICRO.37 26.55,5.97 v26.55,10.3 | v29.24,18.18 30.02,18.96 CPU.24
  Bottom 0.152: v26.55,10.3 27.43,11.18 27.43,17.46 28.16,18.18 v29.24,18.18
N$22  (via drill 0.33)
  Top 0.152: MINI54_MICRO.34 MINI54_MICRO.33 MINI54_MICRO.34 23.79,8.42 v23.59,8.22 | v23.59,8.22 | v30.54,25.89 v30.53,25.88 CPU.25
  Bottom 0.152: v23.59,8.22 23.78,8.41 24.53,8.41 24.74,8.62 24.74,9.9 24.45,10.2 23.64,10.2 23.4,10.43 23.4,14.14 30.54,21.28 v30.54,25.89
N$23
  Top 0.152: IMU.10 13.89,47.43 C14.1
N$28
  Top 0.152: R7.2 21.41,12 LED2.C
N$29
  Top 0.152: U3.28 19.8,12.12 LED2.A
N$36
  Top 0.152: C16.2 28.81,16.14 29.53,15.42 MINI54_MICRO.18
OVM_D0  (via drill 0.33)
  Top 0.152: OV5642.DOUT2 46.31,46.99 46.31,45.07 45.7,44.45 44.38,44.45 43.72,43.79 42.28,43.79 41.56,43.06 39.57,43.06 39.12,42.61 38.93,42.61 38.53,42.2 38.53,39.45 38.07,38.99 37.85,38.99 37.57,38.71 v37.57,38.38 | CPU.62 27.55,34.04 27.55,32.82 27.98,32.4 31.41,32.4 32.02,33.01 32.06,33.05 35.02,33.05 35.81,33.84 36.1,33.84 v36.99,34.73
  Bottom 0.152: v37.57,38.38 36.99,37.79 v36.99,34.73
OVM_D1  (via drill 0.33)
  Top 0.152: CPU.63 27.01,34.05 27.01,32.74 27.68,32.07 31.65,32.07 32.28,32.7 35.11,32.7 35.91,33.5 37.49,33.5 v38.14,34.15 | OV5642.DOUT3 47.55,45.73 45.92,44.1 44.65,44.1 43.98,43.43 42.52,43.43 41.68,42.6 39.85,42.6 39.51,42.25 39.2,42.25 38.94,41.99 38.94,39.15 38.58,38.79 38.58,37.84 38.18,37.44 v38.14,37.44
  Bottom 0.152: v38.14,37.44 v38.14,34.15
OVM_D2  (via drill 0.33)
  Top 0.152: OV5642.DOUT4 43.78,47.01 43.78,45.06 43.18,44.45 41.88,44.45 41.17,43.75 39.28,43.75 38.88,43.35 37.7,43.35 36.87,42.52 36.87,41.2 36.69,41.02 v36.69,39.69 | v33.2,30.3 33.95,29.55 34.72,29.55 35.26,30.1 CPU.44
  Bottom 0.152: v33.2,30.3 33.2,30.83 33.28,30.91 33.63,30.91 34.08,31.35 34.08,32.73 33.27,33.54 33.27,37.57 33.56,37.87 35.13,37.87 35.81,38.54 35.81,38.81 v36.69,39.69
OVM_D3  (via drill 0.33)
  Top 0.152: OV5642.DOUT5 43.45,44.13 42.08,44.13 41.37,43.42 39.41,43.42 39.01,43.01 37.96,43.01 37.74,42.79 v37.74,39.72 | CPU.45 35.98,30.6 v34.6,30.6
  Bottom 0.152: v37.74,39.72 36.41,38.4 36.18,38.4 35.3,37.52 33.74,37.52 33.6,37.38 33.6,33.76 34.44,32.93 34.44,30.76 v34.6,30.6
OVM_D4  (via drill 0.33)
  Top 0.152: OV5642.DOUT6 41.24,47 41.24,45.1 40.58,44.44 38.91,44.44 38.52,44.05 37.28,44.05 36.09,42.87 36.09,41.76 34.64,40.31 v34.64,38.93 | CPU.27 31.52,24.14 31.07,24.59 31.07,25.25 31.39,25.57 31.59,25.57 31.88,25.85 32.27,25.85 32.51,26.08 v32.51,26.17
  Bottom 0.152: v32.51,26.17 32.25,26.43 32.25,30.89 32.95,31.6 33.18,31.6 33.37,31.79 33.37,32.46 32.6,33.24 32.6,37.94 33.59,38.93 v34.64,38.93
OVM_D5  (via drill 0.33)
  Top 0.152: OV5642.DOUT7 40.88,44.1 39.09,44.1 38.69,43.7 37.45,43.7 36.47,42.71 36.47,41.51 35.59,40.63 v35.59,39.63 | CPU.42 v33.03,29.11
  Bottom 0.152: v33.03,29.11 32.98,29.11 32.6,29.49 32.6,29.71 32.59,29.71 32.59,30.68 33.17,31.25 33.4,31.25 33.4,31.24 33.72,31.56 33.72,32.62 32.92,33.42 32.92,37.74 33.4,38.23 34.96,38.23 35.45,38.71 35.45,39.49 v35.59,39.63
OVM_D6  (via drill 0.33)
  Top 0.152: OV5642.DOUT8 38.7,47 38.7,45.04 38.08,44.41 36.91,44.41 35.7,43.2 35.7,41.98 34.49,40.77 33.99,40.77 33.67,40.45 v33.67,39.58 | v32.56,32.12 32.06,31.62 27.51,31.62 26.94,32.19 26.37,32.19 25.78,31.6 CPU.2
  Bottom 0.152: v33.67,39.58 32.23,38.14 32.23,32.75 32.56,32.43 v32.56,32.12
OVM_D7  (via drill 0.33)
  Top 0.152: CPU.54 31.54,34.08 31.54,35.01 30.61,35.94 30.61,36.96 30.62,36.97 v30.62,37.2 | v31.42,40.09 31.45,40.11 31.91,40.11 33.27,41.47 33.64,41.47 33.99,41.81 v33.99,42.09
  Bottom 0.152: v33.99,42.09 36.35,44.45 39.31,44.45 39.97,45.11 OV5642.DOUT9 | v30.62,37.2 30.62,38.65 31.36,39.39 31.36,40.02 v31.42,40.09
OVM_HREF  (via drill 0.33)
  Top 0.152: CPU.29 32.54,25.21 33.16,25.82 33.16,26.45 32.7,26.91 31.29,26.91 v30.97,27.22
  Bottom 0.152: OV5642.HREF 34.86,48.27 33.61,47.02 33.61,45.06 34.56,44.11 34.56,43.56 33.97,42.97 33.45,42.97 33.11,43.31 31.93,43.31 31.32,42.7 31.32,41.92 31.43,41.82 32.22,41.82 32.44,41.59 32.44,40.62 32.04,40.22 32.04,39.86 31.92,39.74 31.92,39.45 31.39,38.92 31.39,27.56 31.05,27.22 v30.97,27.22
OVM_PCLK  (via drill 0.33)
  Top 0.152: OV5642.PCLK 35.3,43.6 35.3,42.11 34.26,41.08 33.46,41.08 32.57,40.19 v32.57,39.6 | v31.75,24.87 32.03,24.59 CPU.28
  Bottom 0.152: v31.75,24.87 31.75,38.82 31.78,38.82 v32.57,39.6
OVM_SCL  (via drill 0.33)
  Top 0.152: OV5642.SCL R4.1 32.34,42.82 30.73,41.21 v30.73,39.61 | CPU.1 24.56,34.64 v25.74,35.82
  Bottom 0.152: 30.73,39.56 v30.73,39.61 30.73,39.52 30.07,38.87 28.64,38.87 28.18,38.41 28.18,38.4 28.18,36.21 27.79,35.82 v25.74,35.82
OVM_SDA
  Top 0.152: CPU.53 32.03,34.98 31.5,35.52 31.5,37.54 31.04,37.99 30.65,37.99 30.27,38.37 30.27,39.04 30,39.31 30,39.96 30.37,40.33 30.37,41.35 31.47,42.46 31.47,42.7 31.48,42.71 31.48,44.33 31.07,44.73 31.07,46.97 | 31.07,46.97 31.07,47.44 31.91,48.27 OV5642.SDA | R6.2 27.61,47.5 28.16,46.95 31.06,46.95 31.07,46.97
OVM_VSYNC  (via drill 0.33)
  Top 0.152: CPU.61 28.02,34.96 27.35,35.63 27.35,35.97 26.02,37.3 25.61,37.3 v25.49,37.42 | v29.27,39.62 29.27,39.43 28.83,38.98 27.98,38.98 27.58,39.38 v26.22,39.38 | v31.71,40.97 32.26,41.52 32.26,41.53 32.26,42.21 32.61,42.56 33.2,42.56 33.62,42.97 34.05,42.97 34.88,43.81 OV5642.VSYNC
  Bottom 0.152: v29.27,39.62 30.62,40.97 v31.71,40.97 | v25.49,37.42 25.49,38.64 v26.22,39.38
OVM_XCLK  (via drill 0.33)
  Top 0.152: v33.77,43.65 33.96,43.83 33.96,44.77 33.62,45.11 33.62,46.65 33.94,46.96 36.15,46.96 37.42,48.24 OV5642.XCLK | CPU.64 26.52,36.18 26.07,36.63 25.38,36.63 24.6,37.41 24.6,37.77 v24.48,37.9 | v25.03,40.73 28.77,40.73 v29.1,41.06
  Bottom 0.152: v29.1,41.06 29.53,41.49 30.3,41.49 30.87,42.06 30.87,42.79 31.73,43.65 v33.77,43.65 | v24.48,37.9 24.48,40.18 v25.03,40.73
P0.0  (via drill 0.33)
  Top 0.152: MINI54_MICRO.38 27.03,5.97 27.03,9.22 27.03,9.69 27.23,9.89 27.23,10.65 26.81,11.07 26.81,11.93 v26.58,12.17 | v28.8,25.29 28.8,24.63 29.53,23.9 29.53,22.64 CPU.23 29.52,19.91 28.25,18.64 27.85,18.64 27.71,18.51 23.93,18.51 23.61,18.19 23.61,15.5 23.91,15.2 24.87,15.2 25.42,15.75 v26.44,15.75 | v8.34,30.06 7.17,31.23 7.17,32.53 6.73,32.96 USB.ID
  Bottom 0.152: v28.8,25.29 27.22,26.87 27.22,28.3 26.69,28.84 26.05,28.84 25.73,28.52 25.73,28.1 25.14,27.52 13.54,27.52 12.05,29.01 12.05,30.75 11.74,31.06 10.39,31.06 9.39,30.06 v8.34,30.06 | v26.58,12.17 26.58,15.62 v26.44,15.75
P0.7  (via drill 0.33)
  Top 0.152: MINI54_MICRO.32 25.03,9.38 v23.78,9.38 | CPU.22 29.05,22.65 29.05,23.66 27.84,24.87 27.84,26.57 28.24,26.97 v29.13,26.97
  Bottom 0.152: v23.78,9.38 23.05,10.11 23.05,14.29 29.67,20.91 29.67,26.61 29.31,26.97 v29.13,26.97
P3.4
  Top 0.152: MINI54_MICRO.9 33.51,11.4 34.53,11.4 35.73,12.59 35.73,18.43 36.05,18.75 38.77,18.75 39.54,19.52 39.54,25.44 37.88,27.1 CPU.38
P3.5
  Top 0.152: MINI54_MICRO.10 33.51,11.94 34.45,11.94 35.37,12.86 35.37,18.62 35.85,19.1 38.56,19.1 39.18,19.73 39.18,25.27 37.86,26.59 CPU.37
P21
  Top 0.152: U3.5 3.44,14.62 2.85,15.21 2.85,17.95 1.67,19.13 1.67,20.21 2.29,20.83 5.2,20.83 6.67,22.3 6.67,24.05 7.43,24.81 9.12,24.81 9.52,25.21 PROGRAM_HEADER.4 | PROGRAM_HEADER.4
P22  (via drill 0.33)
  Top 0.152: U3.4 7.04,15.87 v7.64,16.46 | PROGRAM_HEADER.3 | v8.94,20.47 9.05,20.47 9.51,20.93 9.51,22.84 PROGRAM_HEADER.3
  Bottom 0.152: v7.64,16.46 7.64,19.17 v8.94,20.47
RXMI
  Top 0.152: CPU.51 33.04,34.08 33.02,34.1 33.02,34.94 34.41,36.33 39.02,36.33 39.03,36.33 40.2,36.33 43.09,33.44 45.99,33.44 46.29,33.14 46.58,33.14 47.58,32.14 47.58,16.73 46.95,16.1 46.95,15.81 45.44,14.31 45.44,10.76 46.54,9.66 MICRO_SD_CARD_SINK.3
RXMI_BLE  (via drill 0.33)
  Top 0.152: U3.23 13.31,5.87 10.76,8.42 10.76,14.36 13.86,17.46 20.39,17.46 v21.33,18.4 | v25.01,17.77 25.52,17.25 29.86,17.25 31.32,18.72 31.32,19.41 31.92,20.02 v33.04,20.02 | v42.3,24.99 41.37,24.99 40.21,26.15 40.21,26.98 39.61,27.58 CPU.39
  Bottom 0.152: v21.33,18.4 24.38,18.4 v25.01,17.77 | v33.04,20.02 33.51,19.55 41.77,19.55 43.08,20.85 43.08,24.81 42.9,24.99 v42.3,24.99
SCK  (via drill 0.33)
  Top 0.152: CPU.50 33.53,34.92 34.46,35.85 38.83,35.85 38.83,35.86 40.14,35.86 | MICRO_SD_CARD_SINK.5 47.15,7.46 44.66,9.96 44.66,14.03 46.61,15.98 46.61,16.27 47.19,16.85 47.19,32.01 46.43,32.77 46.16,32.77 45.83,33.11 42.88,33.11 40.14,35.86 | 40.14,35.86 40.14,34.79 v40.25,34.68 | v43.24,35.47 43.24,36.41 LED1.A
  Bottom 0.152: v40.25,34.68 42.46,34.68 v43.24,35.47
SSBLE  (via drill 0.33)
  Top 0.152: 28.54,36.2 SW2.4 | U3.29 v14.09,13.37 | PROGRAM_HEADER.7 | v12.05,18.47 PROGRAM_HEADER.7 | PROGRAM_HEADER.7 12.18,22.97 12.18,24.82 12.38,25.02 13.92,25.02 14.26,25.36 14.26,28.44 13.7,29.01 13.38,29.01 13.33,29.05 v13.33,30.24 | CPU.57 30.01,34.08 30.01,34.9 29.88,35.03 28.93,35.03 28.48,35.48 SW2.4 | v17.66,31.79 17.66,34.13 v18.62,35.09 | 28.21,36.1 SW2.4 | v21.78,36.1 23.32,36.1 23.8,36.58 23.8,37.32 23.61,37.51 23.61,38.62 24.06,39.07 24.87,39.07 25.61,38.33 | SW2.4 28.09,36.76 27.19,36.76 26.99,36.96 26.97,36.96 25.61,38.33 | 25.61,38.33
  Bottom 0.152: v14.09,13.37 13.73,13.37 12.97,14.13 12.97,17.55 v12.05,18.47 | v17.66,31.79 17.7,31.75 17.7,31.44 16.49,30.23 v13.34,30.23 v13.33,30.24 | v18.62,35.09 20.78,35.09 v21.78,36.1
SSSD  (via drill 0.33)
  Top 0.152: 49.24,10.7 47.78,10.7 MICRO_SD_CARD_SINK.2 46.82,10.76 46.44,11.14 46.44,14.04 v46.41,14.06 | CPU.49 34.06,34.08 34.06,34.88 34.57,35.4 38.89,35.4 39.31,34.98 39.31,33.46 39.96,32.81 42.69,32.81 42.75,32.75 45.7,32.75 45.91,32.55 45.91,32.54 46.03,32.41 46.3,32.41 46.83,31.88 46.83,17.12 46.4,16.68 45.6,16.68 45.41,16.49 v45.41,16.15
  Bottom 0.152: v46.41,14.06 46.38,14.06 46.38,15.18 v45.41,16.15
TXMO  (via drill 0.33)
  Top 0.152: CPU.52 32.57,34.09 32.54,34.12 32.54,34.97 34.33,36.76 39.1,36.76 40.27,36.76 43.23,33.8 46.17,33.8 46.5,33.47 46.77,33.47 47.98,32.26 v47.98,15.62 | MICRO_SD_CARD_SINK.7 46.46,5.26 46.07,5.66 46.07,6.46 v44.75,7.78
  Bottom 0.152: v44.75,7.78 44.75,10.38 47.38,13.02 47.38,15.04 v47.98,15.62
TXMO_BLE  (via drill 0.33)
  Top 0.152: U3.24 13.37,7.12 11.48,9 11.48,14.21 14.09,16.81 21.58,16.81 v22.33,17.56 | v32.19,19.07 30.05,16.92 v24.29,16.92 | v41.48,26.64 41.48,27 40.39,28.09 36,28.09 CPU.40
  Bottom 0.152: v32.19,19.07 40.38,19.07 40.38,19.06 42.07,19.06 43.53,20.52 43.53,25.73 42.62,26.64 v41.48,26.64 | v22.33,17.56 23.65,17.56 v24.29,16.92